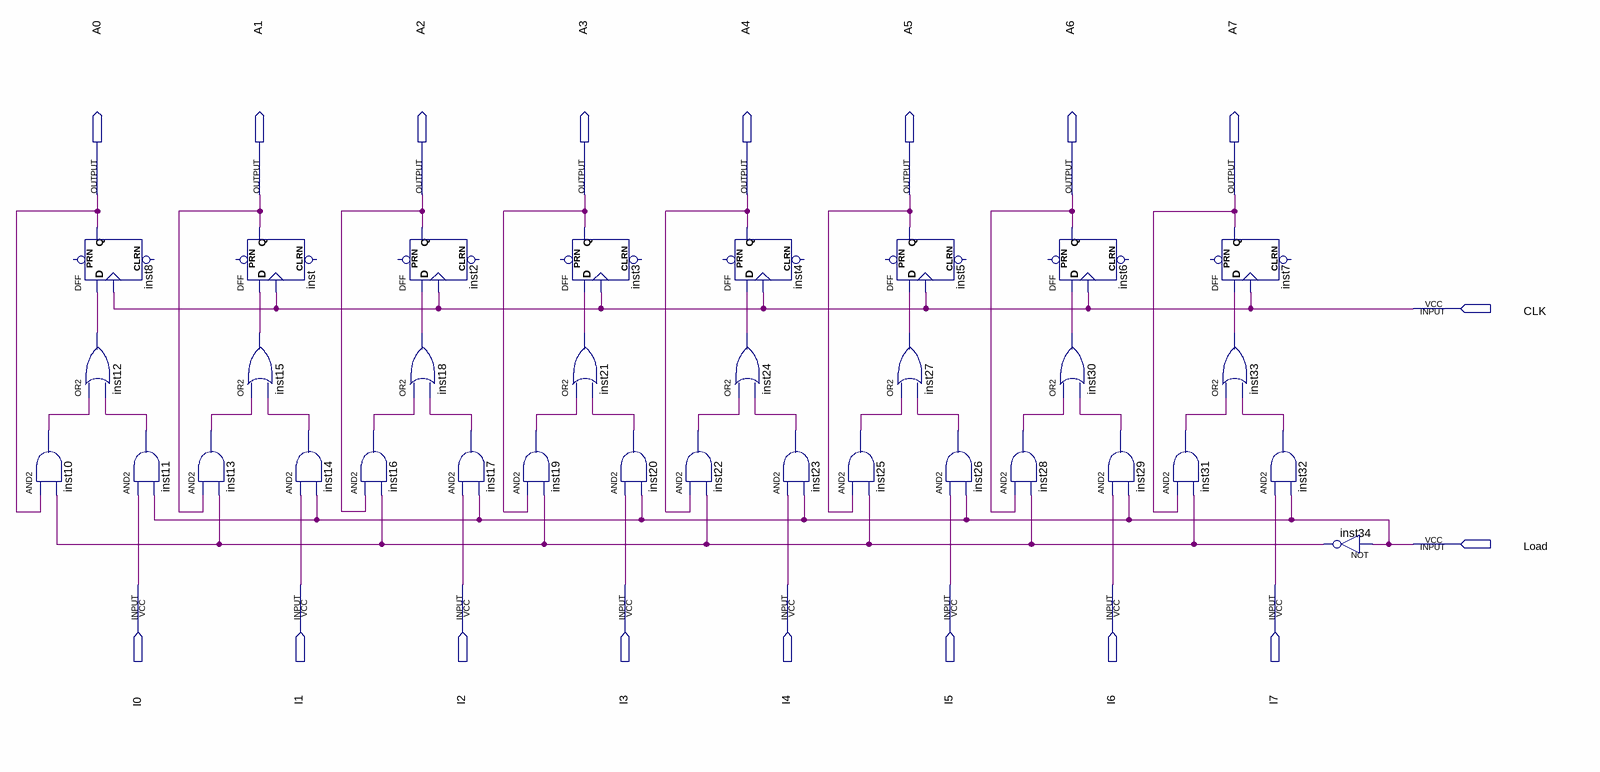
[diagram p0: schematic sheet]
// Quartus schematic lab03.bdf as structural Verilog: 33 symbols, 18 pins
module lab03 (
  input  CLK,
  input  Load,
  input  I0,
  input  I1,
  input  I2,
  input  I3,
  input  I4,
  input  I5,
  input  I6,
  input  I7,
  output A0,
  output A1,
  output A2,
  output A3,
  output A4,
  output A5,
  output A6,
  output A7
);

  wire inst10_out, inst11_out, inst12_out, inst13_out, inst14_out, inst15_out, inst16_out, inst17_out,
       inst18_out, inst19_out, inst20_out, inst21_out, inst22_out, inst23_out, inst24_out, inst25_out,
       inst26_out, inst27_out, inst28_out, inst29_out, inst30_out, inst31_out, inst32_out, inst33_out,
       inst34_out;

  and inst10 (inst10_out, A0, inst34_out);
  DFF inst8 (.CLK(CLK), .D(inst12_out), .Q(A0));  // open: CLRN, PRN
  or inst12 (inst12_out, inst10_out, inst11_out);
  and inst11 (inst11_out, I0, Load);
  DFF inst (.CLK(CLK), .D(inst15_out), .Q(A1));  // open: CLRN, PRN
  or inst15 (inst15_out, inst13_out, inst14_out);
  and inst13 (inst13_out, A1, inst34_out);
  and inst14 (inst14_out, I1, Load);
  and inst16 (inst16_out, A2, inst34_out);
  DFF inst2 (.CLK(CLK), .D(inst18_out), .Q(A2));  // open: CLRN, PRN
  or inst18 (inst18_out, inst16_out, inst17_out);
  and inst17 (inst17_out, I2, Load);
  DFF inst3 (.CLK(CLK), .D(inst21_out), .Q(A3));  // open: CLRN, PRN
  or inst21 (inst21_out, inst19_out, inst20_out);
  and inst19 (inst19_out, A3, inst34_out);
  and inst20 (inst20_out, I3, Load);
  and inst22 (inst22_out, A4, inst34_out);
  DFF inst4 (.CLK(CLK), .D(inst24_out), .Q(A4));  // open: CLRN, PRN
  or inst24 (inst24_out, inst22_out, inst23_out);
  and inst23 (inst23_out, I4, Load);
  DFF inst5 (.CLK(CLK), .D(inst27_out), .Q(A5));  // open: CLRN, PRN
  or inst27 (inst27_out, inst25_out, inst26_out);
  and inst25 (inst25_out, A5, inst34_out);
  and inst26 (inst26_out, I5, Load);
  and inst28 (inst28_out, A6, inst34_out);
  DFF inst6 (.CLK(CLK), .D(inst30_out), .Q(A6));  // open: CLRN, PRN
  or inst30 (inst30_out, inst28_out, inst29_out);
  and inst29 (inst29_out, I6, Load);
  DFF inst7 (.CLK(CLK), .D(inst33_out), .Q(A7));  // open: CLRN, PRN
  or inst33 (inst33_out, inst31_out, inst32_out);
  and inst31 (inst31_out, A7, inst34_out);
  and inst32 (inst32_out, I7, Load);
  not inst34 (inst34_out, Load);
endmodule
